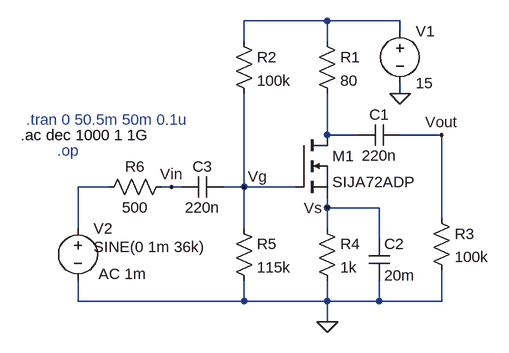
[diagram p0: schematic mosfet_cs.asc]
mosfet_cs.asc, the LTspice schematic file:
Version 4.1
SHEET 1 880 680
WIRE 224 -80 96 -80
WIRE 336 -80 224 -80
WIRE 336 -64 336 -80
WIRE 96 -48 96 -80
WIRE 224 -48 224 -80
WIRE 336 32 336 16
WIRE 224 96 224 32
WIRE 272 96 224 96
WIRE 400 96 336 96
WIRE -112 176 -160 176
WIRE -16 176 -32 176
WIRE 0 176 -16 176
WIRE 96 176 96 32
WIRE 96 176 64 176
WIRE 176 176 96 176
WIRE 224 208 224 192
WIRE 304 208 224 208
WIRE 400 224 400 96
WIRE -160 240 -160 176
WIRE 96 240 96 176
WIRE 224 240 224 208
WIRE 304 256 304 208
WIRE -160 352 -160 320
WIRE 96 352 96 320
WIRE 96 352 -160 352
WIRE 224 352 224 320
WIRE 224 352 96 352
WIRE 304 352 304 320
WIRE 304 352 224 352
WIRE 400 352 400 304
WIRE 400 352 304 352
WIRE 224 384 224 352
FLAG 400 96 Vout
FLAG 336 32 0
FLAG 224 384 0
FLAG -16 176 Vin
FLAG 96 176 Vg
FLAG 224 208 Vs
SYMBOL nmos 176 96 R0
SYMATTR InstName M1
SYMATTR Value SIJA72ADP
SYMBOL res 208 -64 R0
SYMATTR InstName R1
SYMATTR Value 80
SYMBOL voltage -160 224 R0
WINDOW 123 32 86 Left 2
WINDOW 39 0 0 Left 0
WINDOW 3 24 44 Left 2
SYMATTR Value2 AC 1m
SYMATTR Value SINE(0 1m 36k)
SYMATTR InstName V2
SYMBOL res 80 -64 R0
SYMATTR InstName R2
SYMATTR Value 100k
SYMBOL voltage 336 -80 R0
WINDOW 123 0 0 Left 0
WINDOW 39 0 0 Left 0
SYMATTR InstName V1
SYMATTR Value 15
SYMBOL res 384 208 R0
SYMATTR InstName R3
SYMATTR Value 100k
SYMBOL res 208 224 R0
SYMATTR InstName R4
SYMATTR Value 1k
SYMBOL cap 288 256 R0
SYMATTR InstName C2
SYMATTR Value 20m
SYMBOL res 80 224 R0
SYMATTR InstName R5
SYMATTR Value 115k
SYMBOL cap 64 160 R90
WINDOW 0 0 32 VBottom 2
WINDOW 3 32 32 VTop 2
SYMATTR InstName C3
SYMATTR Value 220n
SYMBOL res -16 160 R90
WINDOW 0 0 56 VBottom 2
WINDOW 3 32 56 VTop 2
SYMATTR InstName R6
SYMATTR Value 500
SYMBOL cap 336 80 R90
WINDOW 0 0 32 VBottom 2
WINDOW 3 32 32 VTop 2
SYMATTR InstName C1
SYMATTR Value 220n
TEXT -248 96 Left 2 !.ac dec 1000 1 1G
TEXT -192 120 Left 2 ;.op
TEXT -240 72 Left 2 ;.tran 0 50.5m 50m 0.1u

The netlist it stands for:
* mosfet_cs.asc
M1 N002 Vg Vs Vs SIJA72ADP
R1 N001 N002 80
V2 N003 0 SINE(0 1m 36k) AC 1m
R2 N001 Vg 100k
V1 N001 0 15
R3 Vout 0 100k
R4 Vs 0 1k
C2 Vs 0 20m
R5 Vg 0 115k
C3 Vg Vin 220n
R6 Vin N003 500
C1 Vout N002 220n
.model NMOS NMOS
.model PMOS PMOS
.lib standard.mos
.ac dec 1000 1 1G
* .op
* .tran 0 50.5m 50m 0.1u
.backanno
.end